# Altium project Sample 1.PrjPCB
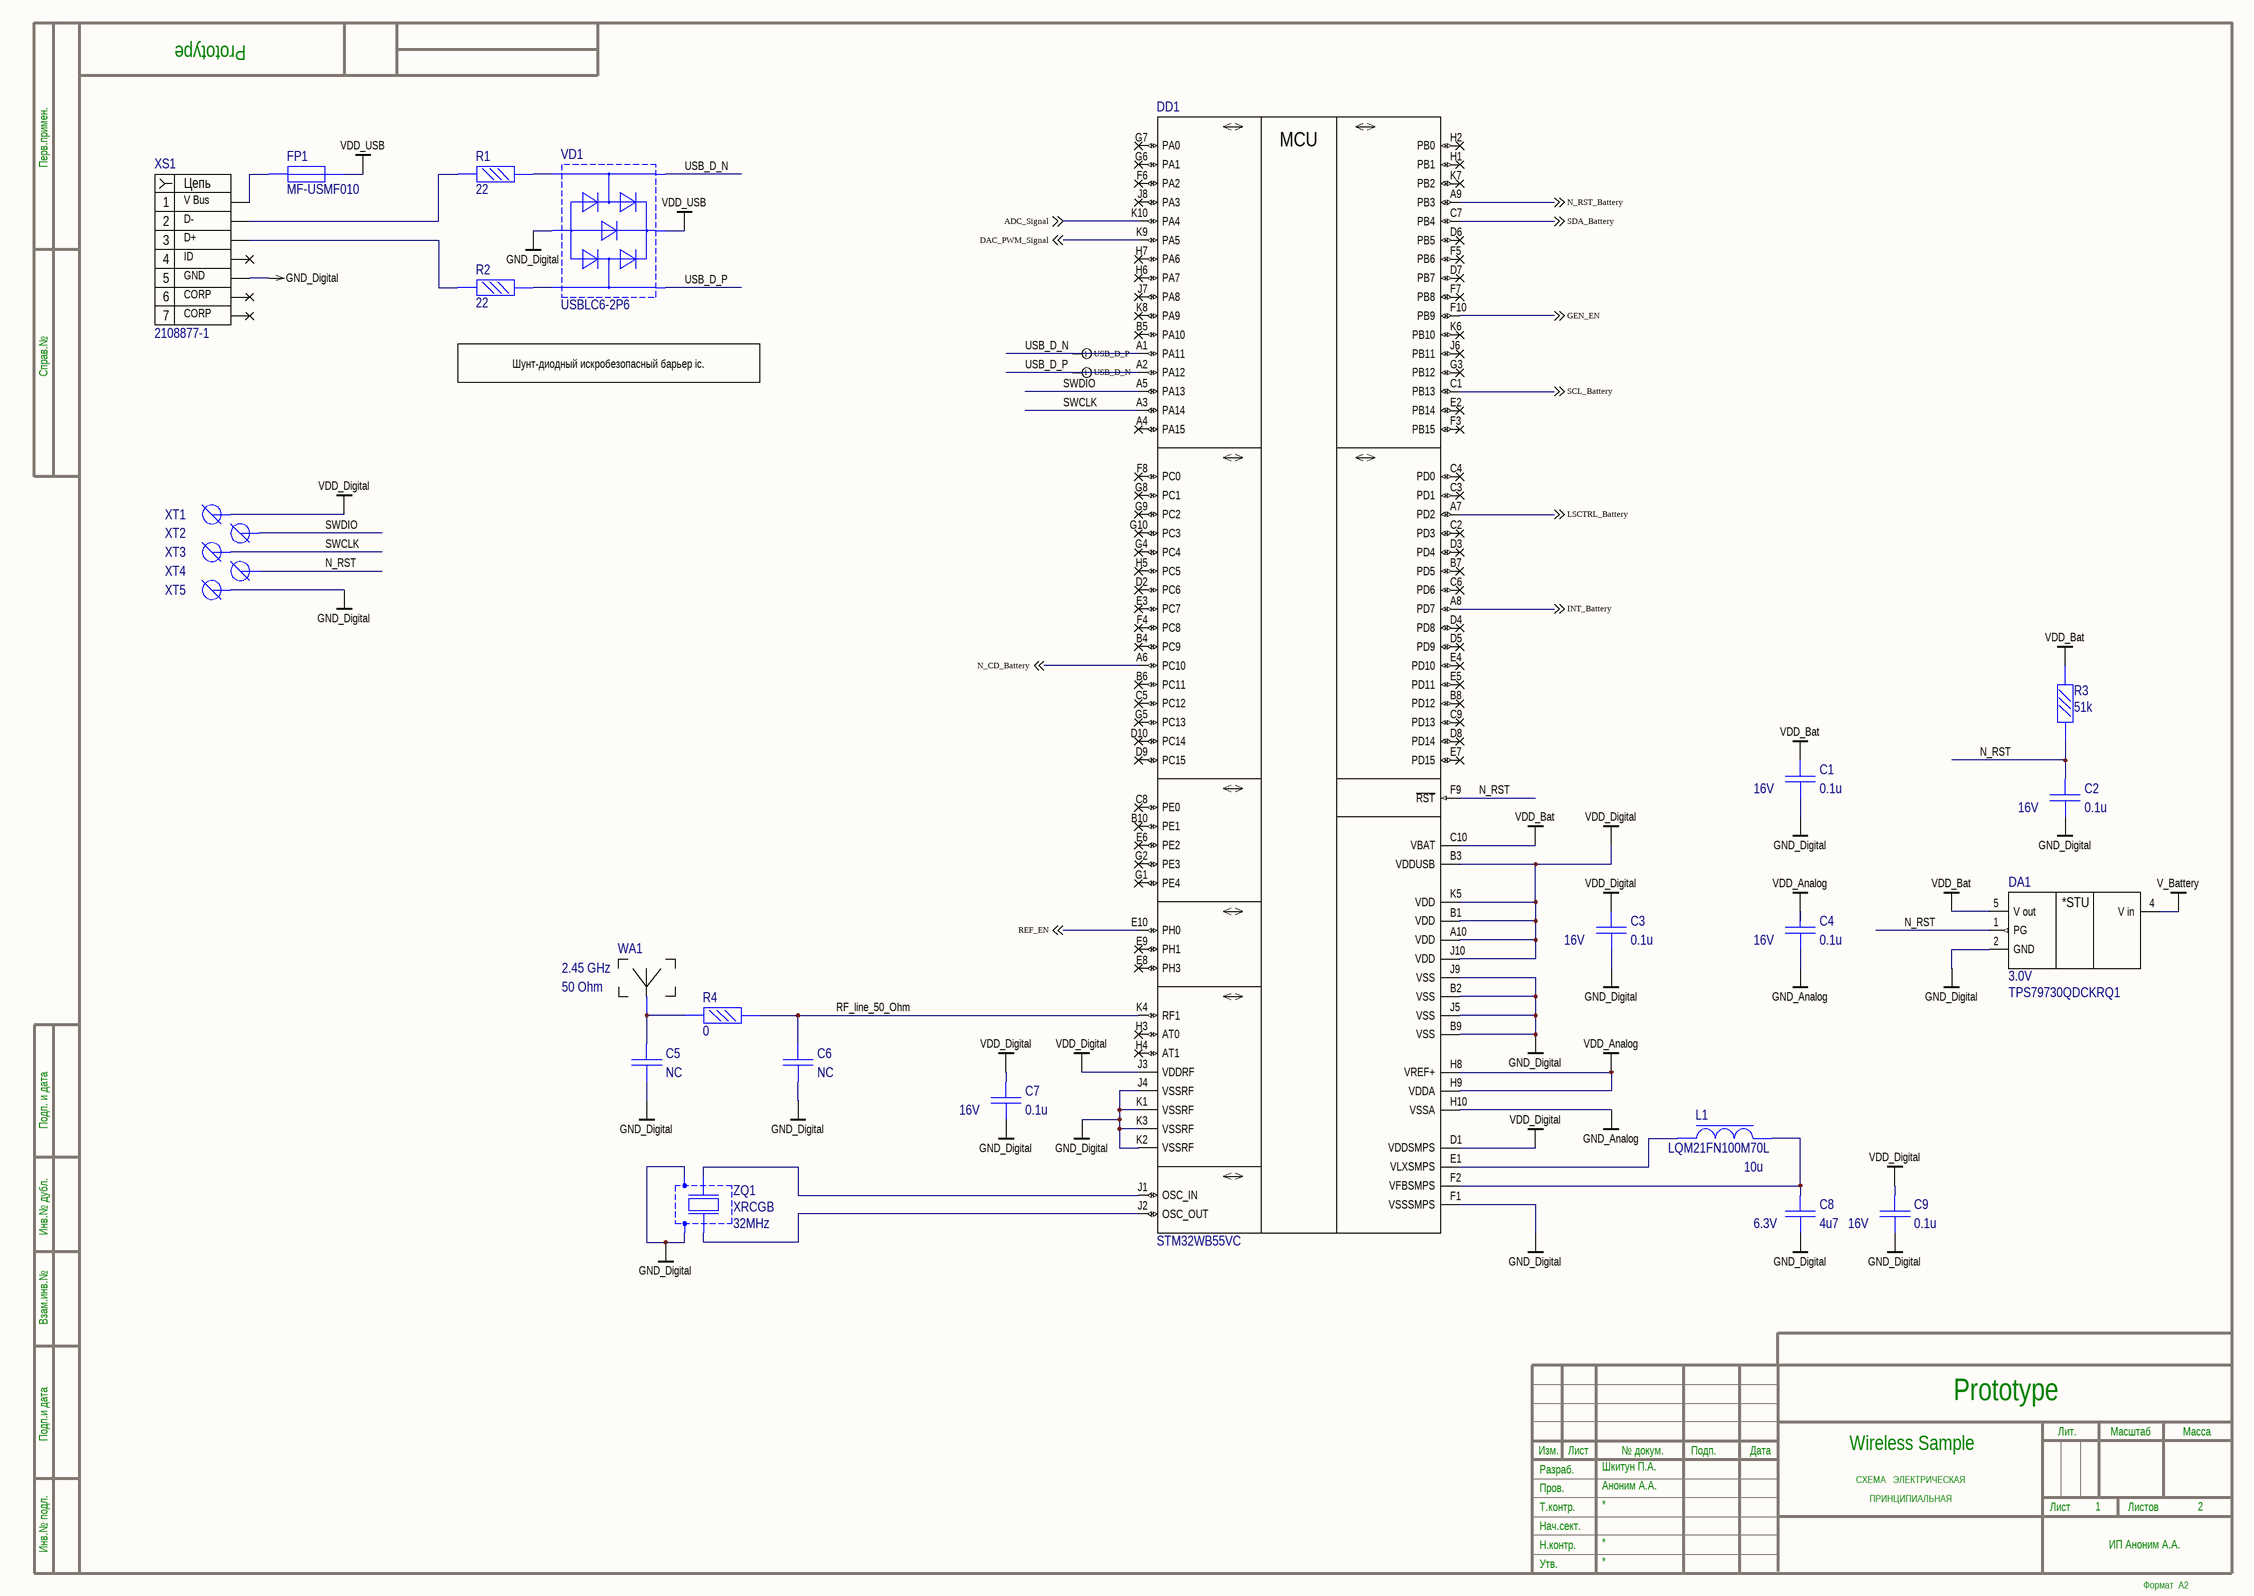
[diagram p0: Sheet_1.SchDoc]
2 sheets, 77 parts. Net scope: global (net labels, ports and power ports of the same name join across sheets).
Board file: Sample_1.PcbDoc
Sheets:
  Sheet_1.SchDoc
  Sheet_2.SchDoc

## Sheet Sheet_1.SchDoc
size 594 x 420 mm; CheckedBy: Аноним А.А.; Author: Шкитун П.А.; CompanyName: ИП Аноним А.А.; SheetNumber: 1; SheetTotal: 2; Name: Wireless Sample; DecimalNumber: Prototype

### Parts
C1  value 0.1u  Voltage: 16V  [C0201_2]  (hidden comment: X7R)
C2  value 0.1u  Voltage: 16V  [C0201_2]  (hidden comment: X7R)
C3  value 0.1u  Voltage: 16V  [C0201_2]  (hidden comment: X7R)
C4  value 0.1u  Voltage: 16V  [C0201_2]  (hidden comment: X7R)
C5  value NC  [C0201_C0G]  (hidden comment: C0G)
C6  value NC  [C0201_C0G]  (hidden comment: C0G)
C7  value 0.1u  Voltage: 16V  [C0201_2]  (hidden comment: X7R)
C8  value 4u7  Voltage: 6.3V  [C0603]  (hidden comment: X7R)
C9  value 0.1u  Voltage: 16V  [C0201_2]  (hidden comment: X7R)
DA1  value 3.0V  [SC70-5]  (hidden comment: TPS79730QDCKRQ1)
DD1  STM32WB55VC  [WLCSP-100]
FP1  value MF-USMF010  [F1210]  (hidden comment: MF-USM005)
L1  value 10u  [L0805]  (hidden comment: LQM21FN100M70L)
R1  value 22  [R0201_2]  (hidden comment: ERJ1GN)
R2  value 22  [R0201_2]  (hidden comment: ERJ1GN)
R3  value 51k  [R0201_2]  (hidden comment: ERJ1GN)
R4  value 0  [R0201_2]  (hidden comment: ERJ1GN)
VD1  USBLC6-2P6  [SOT-666]
WA1  value 2.45 GHz  Z: 50 Ohm  [AMCA31-2R450G-S1F-T3]  (hidden comment: X7R)
XS1  value 2108877-1  7_line: CORP  1_line: V Bus  2_line: D-  3_line: D+  4_line: ID  5_line: GND  [2108877-1]  (hidden comment: 2108877-1 TE Connectivity)
XT1  Test_Pin  [TEST_PIN_2]  (value not drawn)
XT2  Test_Pin  [TEST_PIN_2]  (value not drawn)
XT3  Test_Pin  [TEST_PIN_2]  (value not drawn)
XT4  Test_Pin  [TEST_PIN_2]  (value not drawn)
XT5  Test_Pin  [TEST_PIN_2]  (value not drawn)
ZQ1  value 32MHz  [XRCGB]  (hidden comment: XRCGB)

### Nets
GND_Analog: C4.2 DD1.H10(VSSA)
GND_Digital: C1.2 C2.2 C3.2 C5.2 C6.2 C7.2 C8.2 C9.2 DA1.2(GND) DD1.B2(VSS) DD1.B9(VSS) DD1.F1(VSSSMPS) DD1.J4(VSSRF) DD1.J5(VSS) DD1.J9(VSS) DD1.K1(VSSRF) DD1.K2(VSSRF) DD1.K3(VSSRF) VD1.2(GND) XS1.5(GND) XT5.1 ZQ1.2 ZQ1.4
V_Battery: DA1.4(V_in)
VDD_Analog: C4.1 DD1.H8(VREF+) DD1.H9(VDDA)
VDD_Bat: C1.1 DA1.5(V_out) DD1.C10(VBAT) R3.2
VDD_Digital: C3.1 C7.1 C9.1 DD1.A10(VDD) DD1.B1(VDD) DD1.B3(VDDUSB) DD1.D1(VDDSMPS) DD1.J3(VDDRF) DD1.J10(VDD) DD1.K5(VDD) XT1.1
VDD_USB: FP1.2 VD1.5(V_bus)
ADC_Signal: DD1.K10(PA4) ; off-sheet ADC_Signal
DAC_PWM_Signal: DD1.K9(PA5) ; off-sheet DAC_PWM_Signal
GEN_EN: DD1.F10(PB9) ; off-sheet GEN_EN
INT_Battery: DD1.A8(PD7) ; off-sheet INT_Battery
LSCTRL_Battery: DD1.A7(PD2) ; off-sheet LSCTRL_Battery
N_CD_Battery: DD1.A6(PC10) ; off-sheet N_CD_Battery
N_RST: C2.1 DA1.1(PG) DD1.F9(~{RST}) R3.1 XT4.1
N_RST_Battery: DD1.A9(PB3) ; off-sheet N_RST_Battery
REF_EN: DD1.E10(PH0) ; off-sheet REF_EN
RF_line_50_Ohm: C6.1 DD1.K4(RF1) R4.2
SCL_Battery: DD1.C1(PB13) ; off-sheet SCL_Battery
SDA_Battery: DD1.C7(PB4) ; off-sheet SDA_Battery
SWCLK: DD1.A3(PA14) XT3.1
SWDIO: DD1.A5(PA13) XT2.1
USB_D_N: DD1.A1(PA11) VD1.4(IO_21)
USB_D_P: DD1.A2(PA12) VD1.6(IO_11)
NetC5_1: C5.1 R4.1 WA1.1
NetC8_1: C8.1 DD1.F2(VFBSMPS) L1.2
NetDD1_E1: DD1.E1(VLXSMPS) L1.1
NetDD1_J1: DD1.J1(OSC_IN) ZQ1.3
NetDD1_J2: DD1.J2(OSC_OUT) ZQ1.1
NetFP1_1: FP1.1 XS1.1(V_bus)
NetR1_1: R1.1 XS1.2(D-)
NetR1_2: R1.2 VD1.3(IO_20)
NetR2_1: R2.1 XS1.3(D+)
NetR2_2: R2.2 VD1.1(IO_10)

Not connected (* = marked no-connect by the designer): DD1 A4(PA15)* B4(PC9)* B5(PA10)* B6(PC11)* B7(PD5)* B8(PD12)* B10(PE1)* C2(PD3)* C3(PD1)* C4(PD0)* C5(PC12)* C6(PD6)* C8(PE0)* C9(PD13)* D2(PC6)* D3(PD4)* D4(PD8)* D5(PD9)* D6(PB5)* D7(PB7)* D8(PD14)* D9(PC15)* D10(PC14)* E2(PB14)* E3(PC7)* E4(PD10)* E5(PD11)* E6(PE2)* E7(PD15)* E8(PH3)* E9(PH1)* F3(PB15)* F4(PC8)* F5(PB6)* F6(PA2)* F7(PB8)* F8(PC0)* G1(PE4)* G2(PE3)* G3(PB12)* G4(PC4)* G5(PC13)* G6(PA1)* G7(PA0)* G8(PC1)* G9(PC2)* G10(PC3)* H1(PB1)* H2(PB0)* H3(AT0)* H4(AT1)* H5(PC5)* H6(PA7)* H7(PA6)* J6(PB11)* J7(PA8)* J8(PA3)* K6(PB10)* K7(PB2)* K8(PA9)*; XS1 4(NC)* 6(Corp_1)* 7(Corp_2)*

### Layout directives
differential pair: USB_D_N, USB_D_P

### Notes on the sheet
- Шунт-диодный искробезопасный барьер ic.
- Перв.примен.
- Справ.№
- Подп. и дата
- Инв.№ дубл.
- Взам.инв.№
- Подп.и дата
- Разраб.
- Изм.
- Лист
- № докум.
- Подп.
- Дата
- Лит.
- Масштаб
- Масса
- Т.контр.
- Пров.
- СХЕМА   ЭЛЕКТРИЧЕСКАЯ
- ПРИНЦИПИАЛЬНАЯ
- Листов
- Инв.№ подл.
- Утв.
- Н.контр.
- Нач.сект.
- Формат  A2
- (in symbol 2108877-1) Цепь
- (in symbol STM32WB55VC) MCU
- (in symbol TPS79730QDCKRQ1) *STU

### Library data of the parts
C1-C4 C7 C9 = X7R C0201: Type: Конденсатор; Published: 18.05.2010; Publisher: Andrew Danich
C5 C6 = C0G C0201: Type: Конденсатор; Published: 18.05.2010; Publisher: Andrew Danich
C8 = X7R C0603: Type: Конденсатор; Published: 18.05.2010; Publisher: Andrew Danich
L1 = LQM21FN100M70L: Type: Дроссель; Published: 20.05.2010; Publisher: Andrew Danich; Name: LQM21FN100M70L
R1-R4 = R0201: Published: 19.09.2014; Publisher: Andrew Danich; Type: Резистор
VD1 = USBLC6-2P6: Type: Сборка диодная; Published: 08.07.2014; Publisher: Andrew Danich; Value: USBLC6-2P6
WA1 = AMCA31-2R450G-S1F-T3: Published: 18.05.2010; Publisher: Andrew Danich; Type: Конденсатор
XS1 = 2108877-1: Published: 07.03.2013; Publisher: Andrew Danich; Type: Розетка; 6_line: CORP
DA1 = TPS79730QDCKRQ1: Published: 21.01.2015; Publisher: Andrew Danich; Type: Микросхема; Name: TPS79730QDCKRQ1
DD1 = STM32WB55VC: Published: 16.10.2015; Publisher: Andrew Danich; Type: Микросхема; Value: STM32WB55VC
FP1 = MF-USM005: Published: 24.09.2010; Publisher: Andrew Danich; Type: Вставка плавкая
XT1-XT5 = Test_Pin: Published: 07.03.2013; Publisher: Andrew Danich; Type: Розетка
ZQ1 = XRCGB: Published: 27.08.2015; Publisher: Andrew Danich; Type: Резонатор; Model: XRCGB

## Sheet Sheet_2.SchDoc
size 594 x 420 mm; SheetNumber: 2; DecimalNumber: Prototype
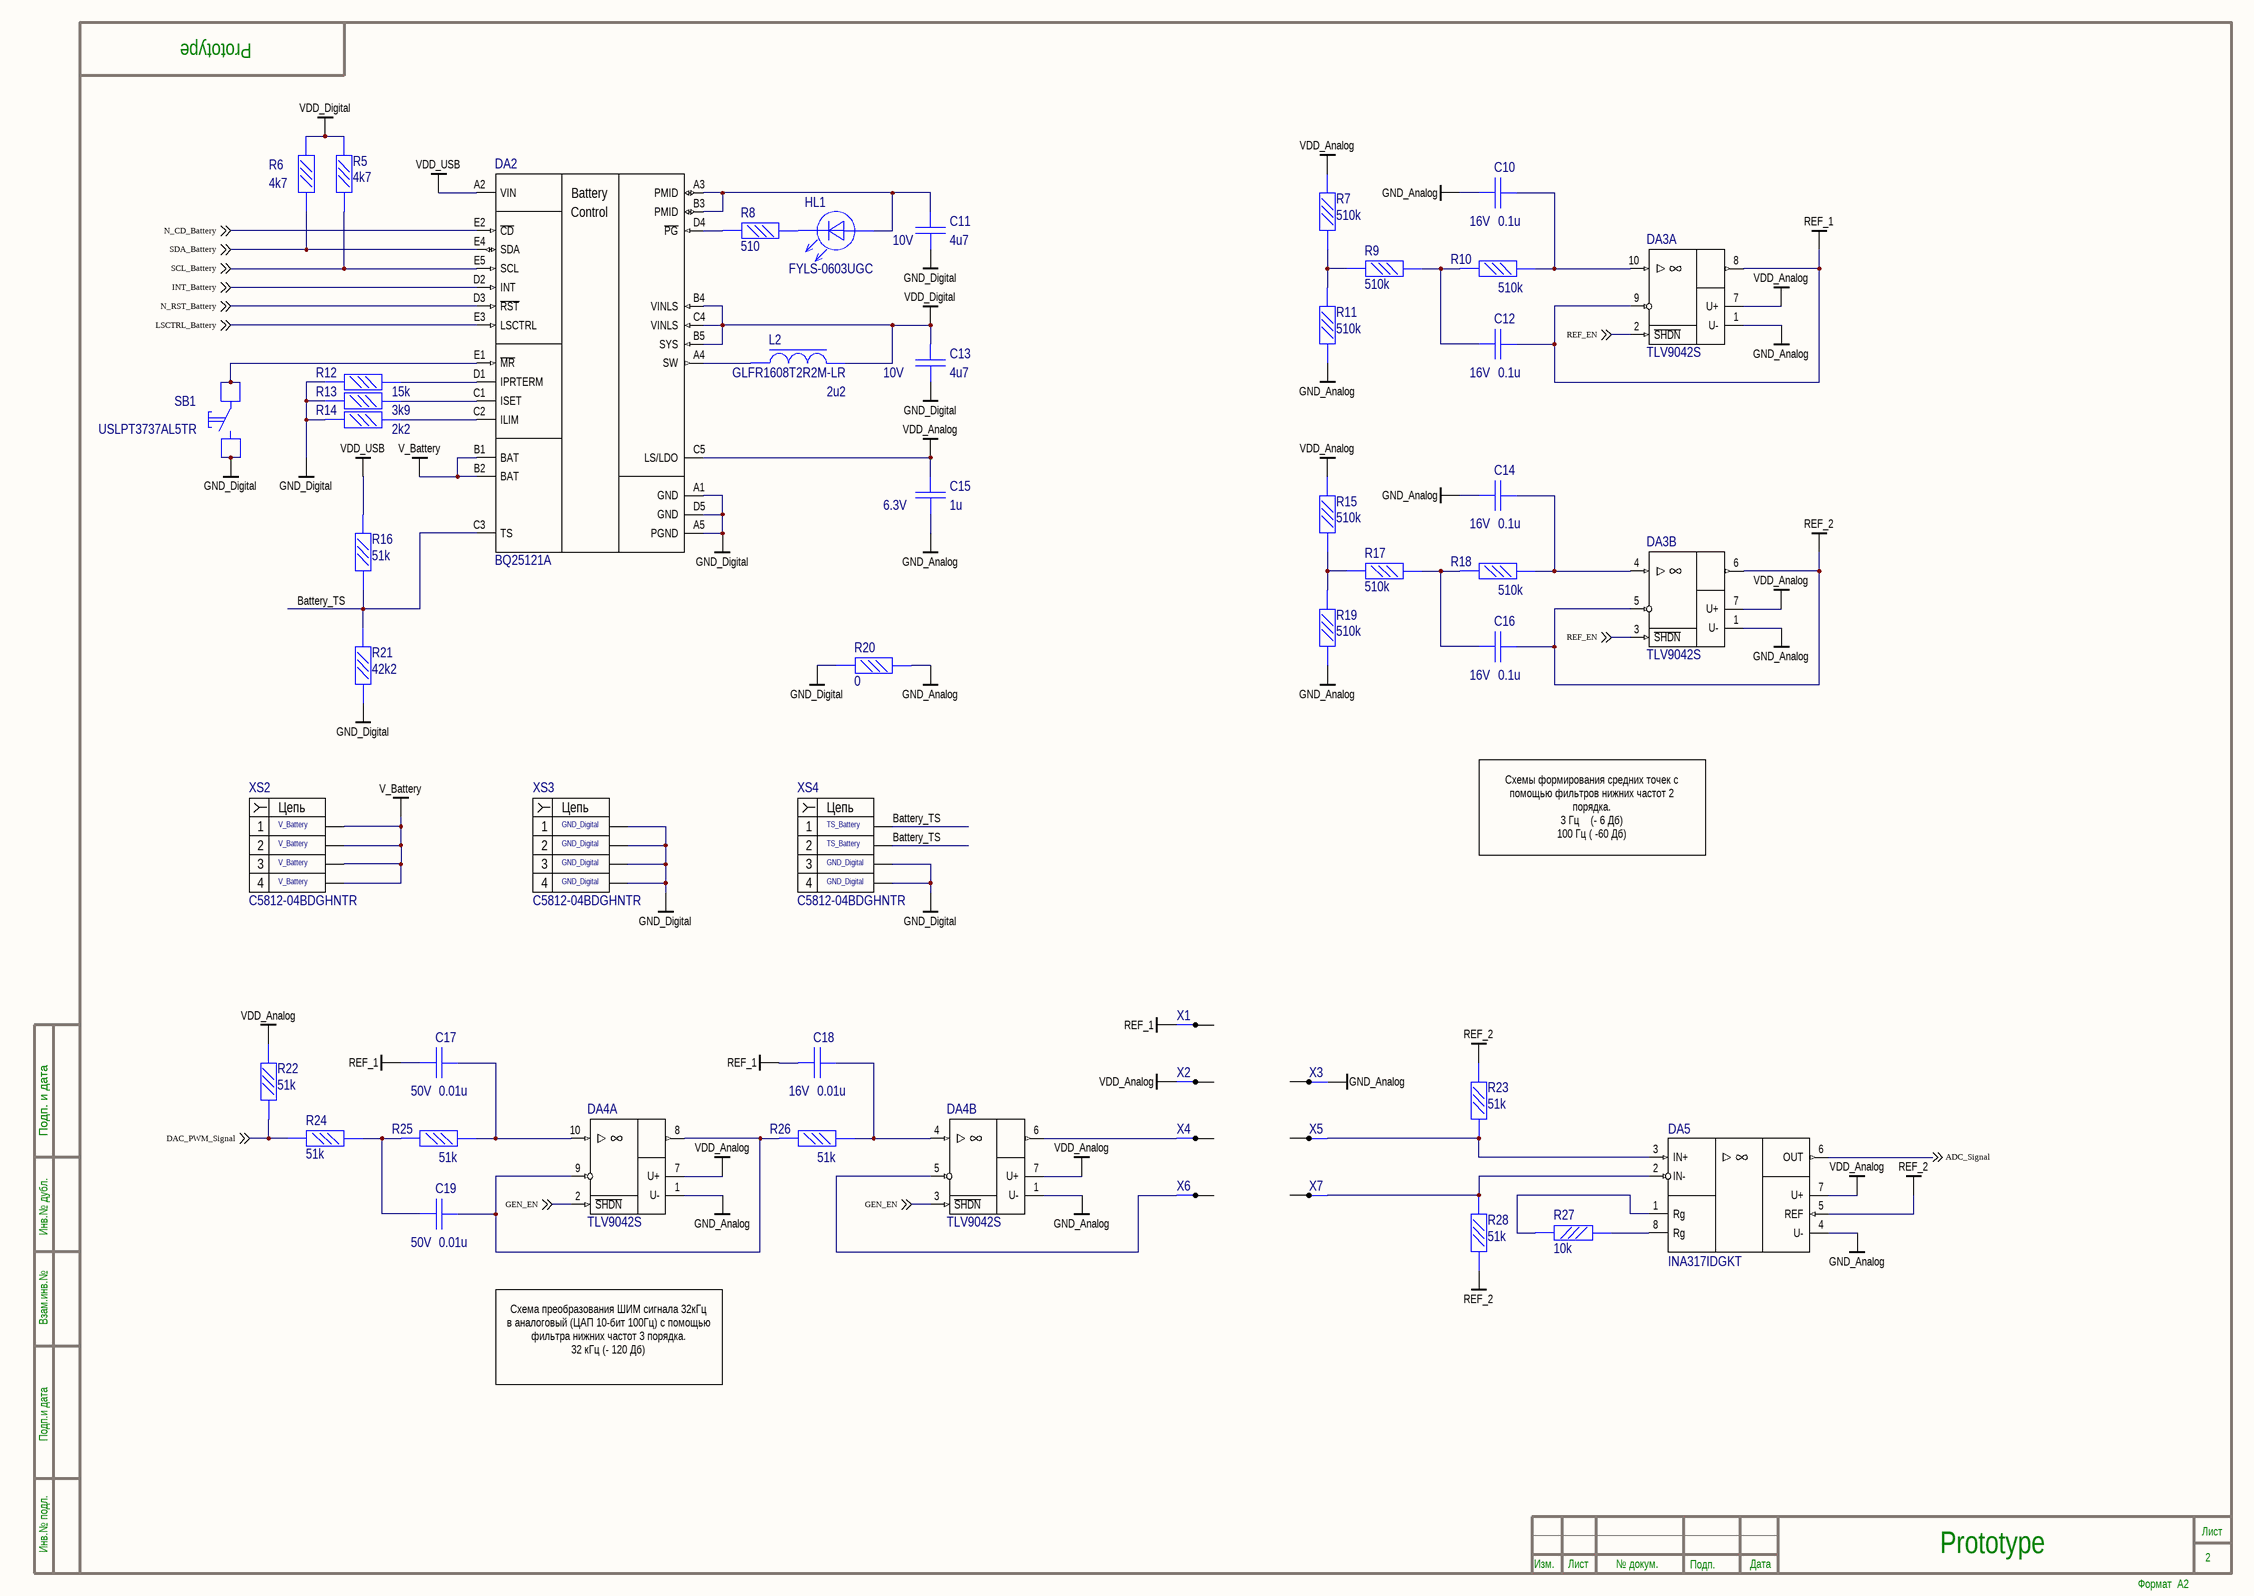
[diagram p1: Sheet_2.SchDoc]

### Parts
C10  value 0.1u  Voltage: 16V  [C0201_2]  (hidden comment: X7R)
C11  value 4u7  Voltage: 10V  [C0603]  (hidden comment: X7R)
C12  value 0.1u  Voltage: 16V  [C0201_2]  (hidden comment: X7R)
C13  value 4u7  Voltage: 10V  [C0603]  (hidden comment: X7R)
C14  value 0.1u  Voltage: 16V  [C0201_2]  (hidden comment: X7R)
C15  value 1u  Voltage: 6.3V  [C0402]  (hidden comment: X5R)
C16  value 0.1u  Voltage: 16V  [C0201_2]  (hidden comment: X7R)
C17  value 0.01u  Voltage: 50V  [C0201_2]  (hidden comment: X7R)
C18  value 0.01u  Voltage: 16V  [C0201_2]  (hidden comment: X7R)
C19  value 0.01u  Voltage: 50V  [C0201_2]  (hidden comment: X7R)
DA2  BQ25121A  [dsbga-25]
DA3  value TLV9042S  [X2QFN]  (hidden comment: TLV9042SIRUGR)  (parts A,B of 2)
DA4  value TLV9042S  [X2QFN]  (hidden comment: TLV9042SIRUGR)  (parts A,B of 2)
DA5  INA317IDGKT  [VSSOP-8]
HL1  FYLS-0603UGC  [LD0603]
L2  value 2u2  [L0603]  (hidden comment: GLFR1608T2R2M-LR)
R5  value 4k7  [R0201_2]  (hidden comment: ERJ1GN)
R6  value 4k7  [R0201_2]  (hidden comment: ERJ1GN)
R7  value 510k  [R0201_2]  (hidden comment: ERJ1GN)
R8  value 510  [R0201_2]  (hidden comment: ERJ1GN)
R9  value 510k  [R0201_2]  (hidden comment: ERJ1GN)
R10  value 510k  [R0201_2]  (hidden comment: ERJ1GN)
R11  value 510k  [R0201_2]  (hidden comment: ERJ1GN)
R12  value 15k  [R0201_2]  (hidden comment: ERJ1GN)
R13  value 3k9  [R0201_2]  (hidden comment: ERJ1GN)
R14  value 2k2  [R0201_2]  (hidden comment: ERJ1GN)
R15  value 510k  [R0201_2]  (hidden comment: ERJ1GN)
R16  value 51k  [R0201_2]  (hidden comment: ERJ1GN)
R17  value 510k  [R0201_2]  (hidden comment: ERJ1GN)
R18  value 510k  [R0201_2]  (hidden comment: ERJ1GN)
R19  value 510k  [R0201_2]  (hidden comment: ERJ1GN)
R20  value 0  [R0201_2]  (hidden comment: ERJ1GN)
R21  value 42k2  [R0201_2]  (hidden comment: ERJ1GN)
R22  value 51k  [R0201_2]  (hidden comment: ERJ1GN)
R23  value 51k  [R0201_2]  (hidden comment: ERJ1GN)
R24  value 51k  [R0201_2]  (hidden comment: ERJ1GN)
R25  value 51k  [R0201_2]  (hidden comment: ERJ1GN)
R26  value 51k  [R0201_2]  (hidden comment: ERJ1GN)
R27  value 10k  [R0201_2]  (hidden comment: ERJ1GN)
R28  value 51k  [R0201_2]  (hidden comment: ERJ1GN)
SB1  USLPT3737AL5TR  [USLPT3737AL5TR]
X1  Contact  [TEST_PIN_2]  (value not drawn)
X2  Contact  [TEST_PIN_2]  (value not drawn)
X3  Contact  [TEST_PIN_2]  (value not drawn)
X4  Contact  [TEST_PIN_2]  (value not drawn)
X5  Contact  [TEST_PIN_2]  (value not drawn)
X6  Contact  [TEST_PIN_2]  (value not drawn)
X7  Contact  [TEST_PIN_2]  (value not drawn)
XS2  1_line: V_Battery  [C5812-04]  (hidden comment: C5812-04BDGHNTR)
XS3  1_line: GND_Digital  [C5812-04]  (hidden comment: C5812-04BDGHNTR)
XS4  1_line: TS_Battery  3_line: GND_Digital  [C5812-04]  (hidden comment: C5812-04BDGHNTR)

### Nets
GND_Analog: C10.1 C14.1 C15.2 DA3.1(U-) DA4.1(U-) DA5.4(U-) R11.1 R19.1 R20.2 X3.1
GND_Digital: C11.2 C13.2 DA2.A1(GND) DA2.A5(PGND) DA2.D5(GND) R12.1 R13.1 R14.1 R20.1 R21.1 SB1.2 SB1.4 XS3.1 XS3.2 XS3.3 XS3.4 XS4.3 XS4.4
REF_1: C12.2 C17.1 C18.1 DA3.8(OUT) DA3.9(IN-) X1.1
REF_2: C16.2 DA3.5(IN-) DA3.6(OUT) DA5.5(REF) R23.2 R28.1
V_Battery: DA2.B1(BAT) DA2.B2(BAT) XS2.1 XS2.2 XS2.3 XS2.4
VDD_Analog: C15.1 DA2.C5(LS/LDO) DA3.7(U+) DA4.7(U+) DA5.7(U+) R7.2 R15.2 R22.2 X2.1
VDD_Digital: C13.1 DA2.B4(VINLS) DA2.B5(SYS) DA2.C4(VINLS) L2.2 R5.2 R6.2
VDD_USB: DA2.A2(VIN) R16.2
ADC_Signal: DA5.6(OUT) ; off-sheet ADC_Signal
Battery_TS: DA2.C3(TS) R16.1 R21.2 XS4.1 XS4.2
DAC_PWM_Signal: R22.1 R24.1 ; off-sheet DAC_PWM_Signal
GEN_EN: DA4.2(~{SHDN}) DA4.3(~{SHDN}) ; off-sheet GEN_EN
INT_Battery: DA2.D2(INT) ; off-sheet INT_Battery
LSCTRL_Battery: DA2.E3(LSCTRL) ; off-sheet LSCTRL_Battery
N_CD_Battery: DA2.E2(~{CD}) ; off-sheet N_CD_Battery
N_RST_Battery: DA2.D3(~{RST}) ; off-sheet N_RST_Battery
REF_EN: DA3.2(~{SHDN}) DA3.3(~{SHDN}) ; off-sheet REF_EN
SCL_Battery: DA2.E5(SCL) R5.1 ; off-sheet SCL_Battery
SDA_Battery: DA2.E4(SDA) R6.1 ; off-sheet SDA_Battery
NetC10_2: C10.2 DA3.10(IN+) R10.2
NetC11_1: C11.1 DA2.A3(PMID) DA2.B3(PMID) HL1.1(А)
NetC12_1: C12.1 R9.2 R10.1
NetC14_2: C14.2 DA3.4(IN+) R18.2
NetC16_1: C16.1 R17.2 R18.1
NetC17_2: C17.2 DA4.10(IN+) R25.2
NetC18_2: C18.2 DA4.4(IN+) R26.2
NetC19_1: C19.1 R24.2 R25.1
NetC19_2: C19.2 DA4.8(OUT) DA4.9(IN-) R26.1
NetDA2_A4: DA2.A4(SW) L2.1
NetDA2_C1: DA2.C1(ISET) R13.2
NetDA2_C2: DA2.C2(ILIM) R14.2
NetDA2_D1: DA2.D1(IPRTERM) R12.2
NetDA2_D4: DA2.D4(~{PG}) R8.1
NetDA2_E1: DA2.E1(~{MR}) SB1.1 SB1.3
NetDA4_5: DA4.5(IN-) X6.1
NetDA4_6: DA4.6(OUT) X4.1
NetDA5_1: DA5.1(Rg) R27.2
NetDA5_2: DA5.2(IN-) R28.2 X7.1
NetDA5_3: DA5.3(IN+) R23.1 X5.1
NetDA5_8: DA5.8(Rg) R27.1
NetHL1_2: HL1.2(К) R8.2
NetR7_1: R7.1 R9.1 R11.2
NetR15_1: R15.1 R17.1 R19.2

### Notes on the sheet
- Схемы формирования средних точек с помощью фильтров нижних частот 2 порядка.
  3 Гц    (- 6 Дб)
  100 Гц ( -60 Дб)
- Схема преобразования ШИМ сигнала 32кГц в аналоговый (ЦАП 10-бит 100Гц) с помощью фильтра нижних частот 3 порядка.
  32 кГц (- 120 Дб)
- Подп. и дата
- Инв.№ дубл.
- Взам.инв.№
- Подп.и дата
- Инв.№ подл.
- Изм.
- Лист
- № докум.
- Подп.
- Дата
- Формат  A2
- (in symbol BQ25121A) Battery; Control
- (in symbol C5812-04BDGHNTR) Цепь

### Library data of the parts
C10 C12 C14 C16-C19 = X7R C0201: Type: Конденсатор; Published: 18.05.2010; Publisher: Andrew Danich
C11 C13 = X7R C0603: Type: Конденсатор; Published: 18.05.2010; Publisher: Andrew Danich
C15 = X5R C0402: Type: Конденсатор; Published: 18.05.2010; Publisher: Andrew Danich
HL1 = FYLS-0603UGC: Type: Индикатор единичный; Published: 03.12.2013; Publisher: Andrew Danich; Value: FYLS-0603UGC
L2 = GLFR1608T2R2M-LR: Type: Дроссель; Published: 20.05.2010; Publisher: Andrew Danich; Name: GLFR1608T2R2M-LR
R5-R28 = R0201: Published: 19.09.2014; Publisher: Andrew Danich; Type: Резистор
DA2 = BQ25121A: Published: 29.07.2015; Publisher: Andrew Danich; Type: Модуль; Value: BQ25121A
DA3 DA4 = TLV9042SIRUGR: Published: 08.12.2013; Publisher: Andrew Danich; Type: Микросхема
DA5 = INA317IDGKT: Published: 19.12.2015; Publisher: Andrew Danich; Type: Микросхема; Value: INA317IDGKT
SB1 = USLPT3737AL5TR: Published: 17.04.2014; Publisher: Andrew Danich; Type: Переключатель; Value: USLPT3737AL5TR
X1-X7 = Contact: Published: 07.03.2013; Publisher: Andrew Danich; Type: Розетка
XS2-XS4 = C5812-04BDGHNTR: Published: 07.03.2013; Publisher: Andrew Danich; Type: Розетка; Value: C5812-04BDGHNTR
  XS2: 2_line: V_Battery; 3_line: V_Battery; 4_line: V_Battery
  XS3: 2_line: GND_Digital; 3_line: GND_Digital; 4_line: GND_Digital
  XS4: 2_line: TS_Battery; 4_line: GND_Digital

## Nets that join several sheets
GND_Analog: Sheet_1 (C4.2 DD1.H10), Sheet_2 (10 pins)
GND_Digital: Sheet_1 (23 pins), Sheet_2 (18 pins)
V_Battery: Sheet_1 (DA1.4), Sheet_2 (6 pins)
VDD_Analog: Sheet_1 (C4.1 DD1.H8 DD1.H9), Sheet_2 (9 pins)
VDD_Digital: Sheet_1 (11 pins), Sheet_2 (7 pins)
VDD_USB: Sheet_1 (FP1.2 VD1.5), Sheet_2 (DA2.A2 R16.2)
ADC_Signal: Sheet_1 (DD1.K10), Sheet_2 (DA5.6)
DAC_PWM_Signal: Sheet_1 (DD1.K9), Sheet_2 (R22.1 R24.1)
GEN_EN: Sheet_1 (DD1.F10), Sheet_2 (DA4.2 DA4.3)
INT_Battery: Sheet_1 (DD1.A8), Sheet_2 (DA2.D2)
LSCTRL_Battery: Sheet_1 (DD1.A7), Sheet_2 (DA2.E3)
N_CD_Battery: Sheet_1 (DD1.A6), Sheet_2 (DA2.E2)
N_RST_Battery: Sheet_1 (DD1.A9), Sheet_2 (DA2.D3)
REF_EN: Sheet_1 (DD1.E10), Sheet_2 (DA3.2 DA3.3)
SCL_Battery: Sheet_1 (DD1.C1), Sheet_2 (DA2.E5 R5.1)
SDA_Battery: Sheet_1 (DD1.C7), Sheet_2 (DA2.E4 R6.1)